# Altium project Ferofluid Clock.PrjPcb
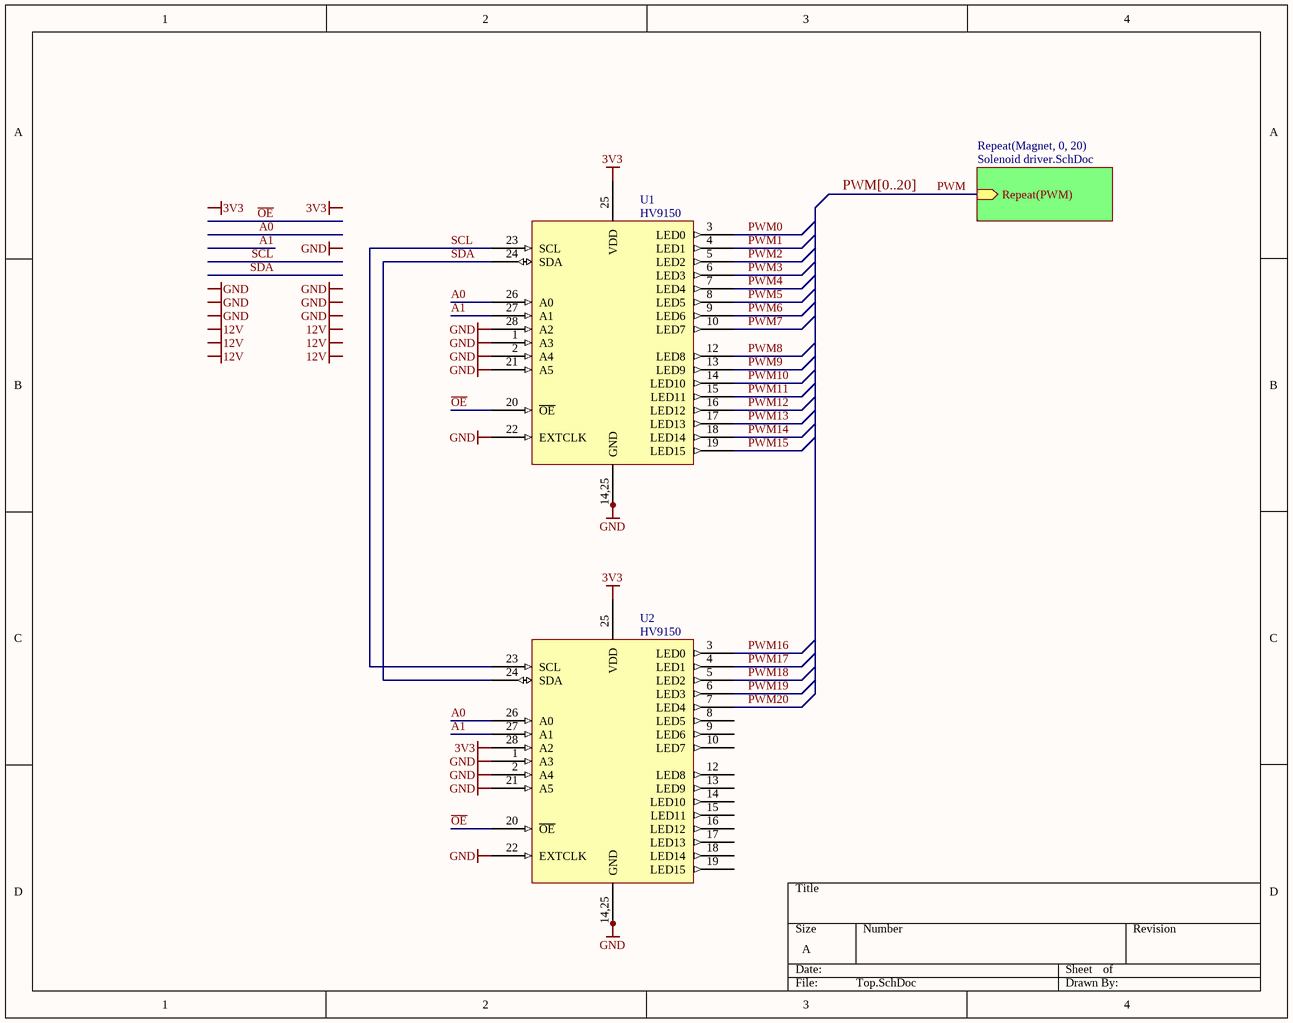
[diagram p0: Top.SchDoc]
2 sheets, 65 parts. Net scope: hierarchical (ports join the sheet entries above them; power ports are global).
Sheets:
  Top.SchDoc
    Magnet0 = Solenoid driver.SchDoc
    Magnet1 = Solenoid driver.SchDoc
    Magnet2 = Solenoid driver.SchDoc
    Magnet3 = Solenoid driver.SchDoc
    Magnet4 = Solenoid driver.SchDoc
    Magnet5 = Solenoid driver.SchDoc
    Magnet6 = Solenoid driver.SchDoc
    Magnet7 = Solenoid driver.SchDoc
    Magnet8 = Solenoid driver.SchDoc
    Magnet9 = Solenoid driver.SchDoc
    Magnet10 = Solenoid driver.SchDoc
    Magnet11 = Solenoid driver.SchDoc
    Magnet12 = Solenoid driver.SchDoc
    Magnet13 = Solenoid driver.SchDoc
    Magnet14 = Solenoid driver.SchDoc
    Magnet15 = Solenoid driver.SchDoc
    Magnet16 = Solenoid driver.SchDoc
    Magnet17 = Solenoid driver.SchDoc
    Magnet18 = Solenoid driver.SchDoc
    Magnet19 = Solenoid driver.SchDoc
    Magnet20 = Solenoid driver.SchDoc

## Sheet Top.SchDoc
size A; SheetNumber: 1; SheetTotal: 2

### Parts
U1  HV9150  [QFN-28]
U2  HV9150  [QFN-28]

### Sub-sheets
Repeat(Magnet, 0, 20) = Solenoid driver.SchDoc: Repeat(PWM) (in)

### Nets
3V3: U1.25(VDD) U2.25(VDD) U2.28(A2)
GND: U1.1(A3) U1.2(A4) U1.14,25(GND) U1.21(A5) U1.22(EXTCLK) U1.25(GND) U1.28(A2) U2.1(A3) U2.2(A4) U2.14,25(GND) U2.21(A5) U2.22(EXTCLK) U2.25(GND)
A0: U1.26(A0) U2.26(A0)
A1: U1.27(A1) U2.27(A1)
~{OE}: U1.20(~{OE}) U2.20(~{OE})
PWM: sheet Repeat(Magnet, 0, 20)/Repeat(PWM)
PWM0: U1.3(LED0)
PWM1: U1.4(LED1)
PWM2: U1.5(LED2)
PWM3: U1.6(LED3)
PWM4: U1.7(LED4)
PWM5: U1.8(LED5)
PWM6: U1.9(LED6)
PWM7: U1.10(LED7)
PWM8: U1.12(LED8)
PWM9: U1.13(LED9)
PWM10: U1.14(LED10)
PWM11: U1.15(LED11)
PWM12: U1.16(LED12)
PWM13: U1.17(LED13)
PWM14: U1.18(LED14)
PWM15: U1.19(LED15)
PWM16: U2.3(LED0)
PWM17: U2.4(LED1)
PWM18: U2.5(LED2)
PWM19: U2.6(LED3)
PWM20: U2.7(LED4)
SCL: U1.23(SCL) U2.23(SCL)
SDA: U1.24(SDA) U2.24(SDA)

Not connected (* = marked no-connect by the designer): U2 8(LED5) 9(LED6) 10(LED7) 12(LED8) 13(LED9) 14(LED10) 15(LED11) 16(LED12) 17(LED13) 18(LED14) 19(LED15)

### Buses and harness runs
bus PWM[0..20]

### Notes on the sheet
- Labels drawn without touching a wire or pin: 3V3, 12V, GND

### Library data of the parts
U1 U2 = PCA9685: High-Voltage Output Hysteretic-Mode Step-Up DC/DC Controller; Ref: HV9150

## Sheet Solenoid driver.SchDoc
size A; SheetNumber: 2; SheetTotal: 2
Used 21 times, as channels Magnet0, Magnet1, Magnet2, Magnet3, Magnet4, Magnet5, Magnet6, Magnet7, Magnet8, Magnet9, Magnet10, Magnet11, Magnet12, Magnet13, Magnet14, Magnet15, Magnet16, Magnet17, Magnet18, Magnet19, Magnet20. Parts and nets are listed once, with the designators drawn on the sheet.
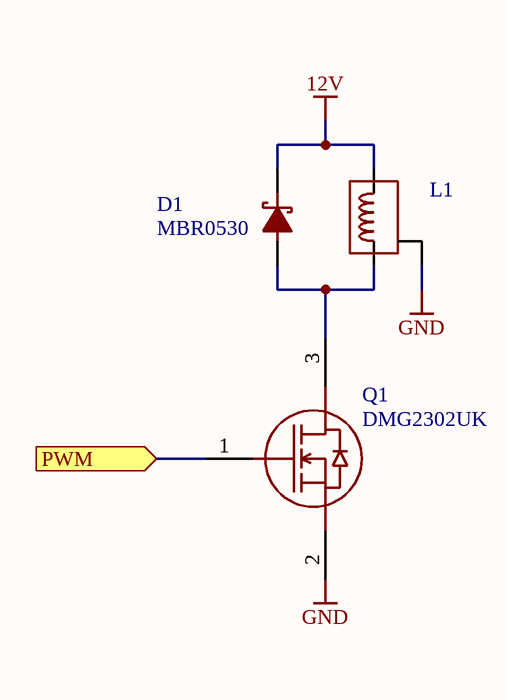
[diagram p1: Solenoid driver.SchDoc]

### Parts
D1  MBR0530  [SOD-123]
L1  (no value)  [P20/15]
Q1  DMG2302UK  [SOT-23]

### Ports
PWM (in)

### Nets
12V: D1.1 L1.2
GND: L1.3 Q1.2(S)
PWM: Q1.1(G) ; port PWM
NetD1_2: D1.2 L1.1 Q1.3(D)

### Channels
Magnet0: designators end in .1; ports PWM=PWM0
Magnet1: designators end in .2; ports PWM=PWM1
Magnet2: designators end in .3; ports PWM=PWM2
Magnet3: designators end in .4; ports PWM=PWM3
Magnet4: designators end in .5; ports PWM=PWM4
Magnet5: designators end in .6; ports PWM=PWM5
Magnet6: designators end in .7; ports PWM=PWM6
Magnet7: designators end in .8; ports PWM=PWM7
Magnet8: designators end in .9; ports PWM=PWM8
Magnet9: designators end in .10; ports PWM=PWM9
Magnet10: designators end in .11; ports PWM=PWM10
Magnet11: designators end in .12; ports PWM=PWM11
Magnet12: designators end in .13; ports PWM=PWM12
Magnet13: designators end in .14; ports PWM=PWM13
Magnet14: designators end in .15; ports PWM=PWM14
Magnet15: designators end in .16; ports PWM=PWM15
Magnet16: designators end in .17; ports PWM=PWM16
Magnet17: designators end in .18; ports PWM=PWM17
Magnet18: designators end in .19; ports PWM=PWM18
Magnet19: designators end in .20; ports PWM=PWM19
Magnet20: designators end in .21; ports PWM=PWM20

### Library data of the parts
D1 = MBR0530: Schottky Barrier Rectifier, 500mA, 30V; Ref: MBR0530LT1G
L1 = P20/15: Generic 806 Inductor
Q1 = DMG2302UK: N-channel MOSFET; Ref: DMG2302UK

## Nets that join several sheets
12V: Magnet0 (D1.1.1 L1.1.2), Magnet1 (D1.2.1 L1.2.2), Magnet2 (D1.3.1 L1.3.2), Magnet3 (D1.4.1 L1.4.2), Magnet4 (D1.5.1 L1.5.2), Magnet5 (D1.6.1 L1.6.2), Magnet6 (D1.7.1 L1.7.2), Magnet7 (D1.8.1 L1.8.2), Magnet8 (D1.9.1 L1.9.2), Magnet9 (D1.10.1 L1.10.2), Magnet10 (D1.11.1 L1.11.2), Magnet11 (D1.12.1 L1.12.2), Magnet12 (D1.13.1 L1.13.2), Magnet13 (D1.14.1 L1.14.2), Magnet14 (D1.15.1 L1.15.2), Magnet15 (D1.16.1 L1.16.2), Magnet16 (D1.17.1 L1.17.2), Magnet17 (D1.18.1 L1.18.2), Magnet18 (D1.19.1 L1.19.2), Magnet19 (D1.20.1 L1.20.2), Magnet20 (D1.21.1 L1.21.2)
GND: Top (13 pins), Magnet0 (L1.1.3 Q1.1.2), Magnet1 (L1.2.3 Q1.2.2), Magnet2 (L1.3.3 Q1.3.2), Magnet3 (L1.4.3 Q1.4.2), Magnet4 (L1.5.3 Q1.5.2), Magnet5 (L1.6.3 Q1.6.2), Magnet6 (L1.7.3 Q1.7.2), Magnet7 (L1.8.3 Q1.8.2), Magnet8 (L1.9.3 Q1.9.2), Magnet9 (L1.10.3 Q1.10.2), Magnet10 (L1.11.3 Q1.11.2), Magnet11 (L1.12.3 Q1.12.2), Magnet12 (L1.13.3 Q1.13.2), Magnet13 (L1.14.3 Q1.14.2), Magnet14 (L1.15.3 Q1.15.2), Magnet15 (L1.16.3 Q1.16.2), Magnet16 (L1.17.3 Q1.17.2), Magnet17 (L1.18.3 Q1.18.2), Magnet18 (L1.19.3 Q1.19.2), Magnet19 (L1.20.3 Q1.20.2), Magnet20 (L1.21.3 Q1.21.2)
PWM0: Top (U1.3), Magnet0 (Q1.1.1)
PWM1: Top (U1.4), Magnet1 (Q1.2.1)
PWM2: Top (U1.5), Magnet2 (Q1.3.1)
PWM3: Top (U1.6), Magnet3 (Q1.4.1)
PWM4: Top (U1.7), Magnet4 (Q1.5.1)
PWM5: Top (U1.8), Magnet5 (Q1.6.1)
PWM6: Top (U1.9), Magnet6 (Q1.7.1)
PWM7: Top (U1.10), Magnet7 (Q1.8.1)
PWM8: Top (U1.12), Magnet8 (Q1.9.1)
PWM9: Top (U1.13), Magnet9 (Q1.10.1)
PWM10: Top (U1.14), Magnet10 (Q1.11.1)
PWM11: Top (U1.15), Magnet11 (Q1.12.1)
PWM12: Top (U1.16), Magnet12 (Q1.13.1)
PWM13: Top (U1.17), Magnet13 (Q1.14.1)
PWM14: Top (U1.18), Magnet14 (Q1.15.1)
PWM15: Top (U1.19), Magnet15 (Q1.16.1)
PWM16: Top (U2.3), Magnet16 (Q1.17.1)
PWM17: Top (U2.4), Magnet17 (Q1.18.1)
PWM18: Top (U2.5), Magnet18 (Q1.19.1)
PWM19: Top (U2.6), Magnet19 (Q1.20.1)
PWM20: Top (U2.7), Magnet20 (Q1.21.1)